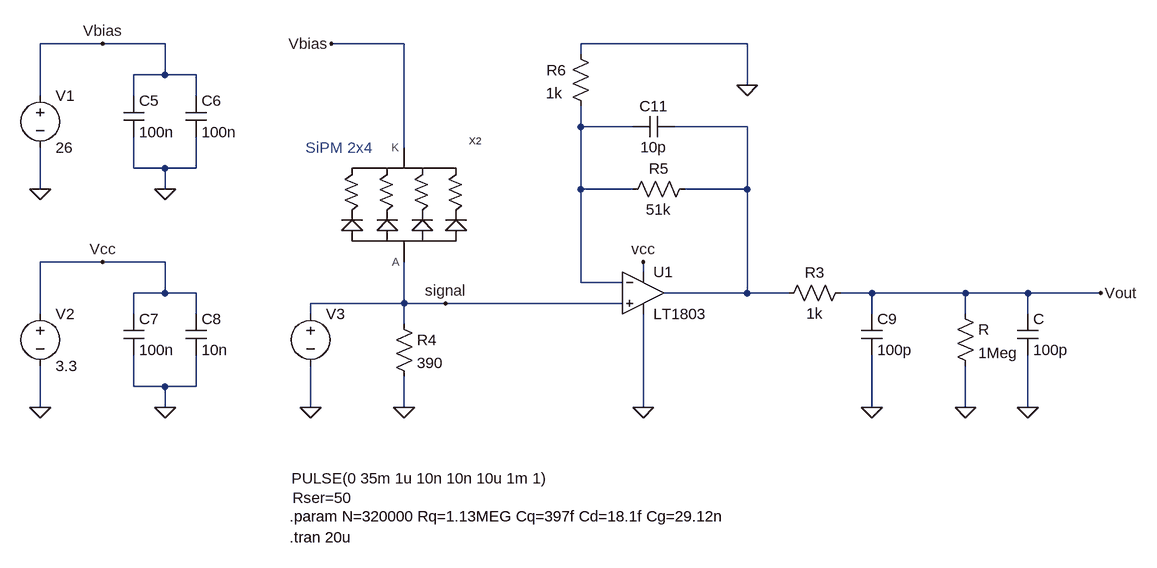
[diagram p0: schematic voltagemode_update.asc]
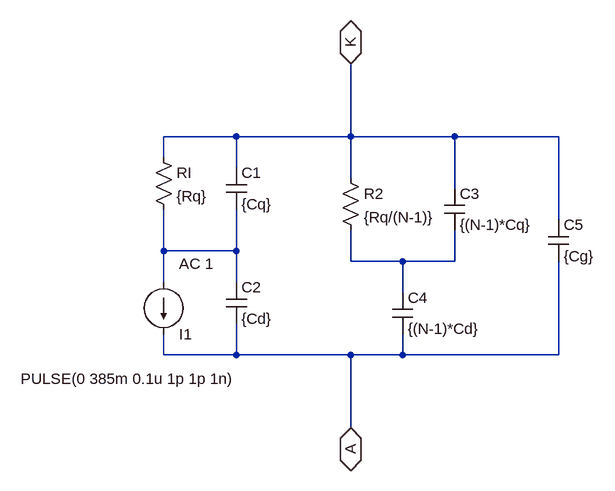
[diagram p1: sub-circuit sipm_equivalente_controllo_tensione_pulse.asc]
voltagemode_update.asc, the LTspice schematic file:
Version 4.1
SHEET 1 1304 1300
WIRE -432 -112 -528 -112
WIRE -336 -112 -432 -112
WIRE 32 -112 -80 -112
WIRE 560 -112 304 -112
WIRE 304 -96 304 -112
WIRE -336 -64 -336 -112
WIRE -336 -64 -384 -64
WIRE -288 -64 -336 -64
WIRE 560 -48 560 -112
WIRE -528 -32 -528 -112
WIRE -384 -32 -384 -64
WIRE -288 -32 -288 -64
WIRE 304 16 304 -16
WIRE 384 16 304 16
WIRE 560 16 448 16
WIRE 32 48 32 -112
WIRE -384 80 -384 32
WIRE -336 80 -384 80
WIRE -288 80 -288 32
WIRE -288 80 -336 80
WIRE -528 112 -528 48
WIRE -336 112 -336 80
WIRE 304 112 304 16
WIRE 384 112 304 112
WIRE 560 112 560 16
WIRE 560 112 464 112
WIRE -432 224 -528 224
WIRE -336 224 -432 224
WIRE 400 240 400 224
WIRE 304 256 304 112
WIRE 368 256 304 256
WIRE -336 272 -336 224
WIRE -336 272 -384 272
WIRE -288 272 -336 272
WIRE 560 272 560 112
WIRE 560 272 432 272
WIRE 624 272 560 272
WIRE 752 272 704 272
WIRE 896 272 752 272
WIRE 992 272 896 272
WIRE 1104 272 992 272
WIRE 32 288 32 224
WIRE 32 288 -112 288
WIRE 96 288 32 288
WIRE 368 288 96 288
WIRE -528 304 -528 224
WIRE -384 304 -384 272
WIRE -288 304 -288 272
WIRE -112 304 -112 288
WIRE 752 304 752 272
WIRE 896 304 896 272
WIRE 992 304 992 272
WIRE 32 320 32 288
WIRE -384 416 -384 368
WIRE -336 416 -384 416
WIRE -288 416 -288 368
WIRE -288 416 -336 416
WIRE -528 448 -528 384
WIRE -336 448 -336 416
WIRE -112 448 -112 384
WIRE 32 448 32 400
WIRE 400 448 400 304
WIRE 752 448 752 368
WIRE 896 448 896 384
WIRE 992 448 992 368
FLAG -528 112 0
FLAG -336 112 0
FLAG 32 448 0
FLAG 400 448 0
FLAG 400 224 vcc
FLAG 560 -48 0
FLAG 96 288 signal
FLAG -112 448 0
FLAG -432 -112 Vbias
FLAG -80 -112 Vbias
FLAG -528 448 0
FLAG -336 448 0
FLAG -432 224 Vcc
FLAG 752 448 0
FLAG 1104 272 Vout
FLAG 992 448 0
FLAG 896 448 0
SYMBOL voltage -528 -48 R0
WINDOW 123 0 0 Left 0
WINDOW 39 0 0 Left 0
SYMATTR InstName V1
SYMATTR Value 26
SYMBOL cap -400 -32 R0
SYMATTR InstName C5
SYMATTR Value 100n
SYMBOL res 16 304 R0
SYMATTR InstName R4
SYMATTR Value 390
SYMBOL res 288 -112 R0
WINDOW 0 -37 41 Left 2
WINDOW 3 -38 76 Left 2
SYMATTR InstName R6
SYMATTR Value 1k
SYMBOL res 480 96 R90
WINDOW 0 0 56 VBottom 2
WINDOW 3 32 56 VTop 2
SYMATTR InstName R5
SYMATTR Value 51k
SYMBOL sipm_equivalente_controllo_tensione_pulse 32 128 R0
SYMATTR InstName X2
SYMBOL voltage -112 288 R0
WINDOW 3 -29 269 Left 2
WINDOW 123 0 0 Left 0
WINDOW 39 -28 299 Left 2
SYMATTR Value PULSE(0 35m 1u 10n 10n 10u 1m 1)
SYMATTR SpiceLine Rser=50
SYMATTR InstName V3
SYMBOL cap -304 -32 R0
SYMATTR InstName C6
SYMATTR Value 100n
SYMBOL voltage -528 288 R0
WINDOW 123 0 0 Left 0
WINDOW 39 0 0 Left 0
SYMATTR InstName V2
SYMATTR Value 3.3
SYMBOL cap -400 304 R0
SYMATTR InstName C7
SYMATTR Value 100n
SYMBOL cap -304 304 R0
SYMATTR InstName C8
SYMATTR Value 10n
SYMBOL cap 448 0 R90
WINDOW 0 0 32 VBottom 2
WINDOW 3 32 32 VTop 2
SYMATTR InstName C11
SYMATTR Value 10p
SYMBOL res 720 256 R90
WINDOW 0 0 56 VBottom 2
WINDOW 3 32 56 VTop 2
SYMATTR InstName R3
SYMATTR Value 1k
SYMBOL cap 736 304 R0
SYMATTR InstName C9
SYMATTR Value 100p
SYMBOL cap 976 304 R0
SYMATTR InstName C
SYMATTR Value 100p
SYMBOL res 880 288 R0
SYMATTR InstName R
SYMATTR Value 1Meg
SYMBOL OpAmps\\LT1803 400 272 R0
SYMATTR InstName U1
TEXT -144 616 Left 2 !.param N=320000 Rq=1.13MEG Cq=397f Cd=18.1f Cg=29.12n
TEXT -144 648 Left 2 !.tran 20u
TEXT -120 48 Left 2 ;SiPM 2x4

sipm_equivalente_controllo_tensione_pulse.asc, the sub-circuit schematic file:
Version 4.1
SHEET 1 3028 692
WIRE 80 16 -32 16
WIRE 256 16 256 -96
WIRE 256 16 80 16
WIRE 416 16 256 16
WIRE 576 16 416 16
WIRE -32 48 -32 16
WIRE 80 64 80 16
WIRE 256 80 256 16
WIRE 416 96 416 16
WIRE 576 144 576 16
WIRE -32 192 -32 128
WIRE 80 192 80 128
WIRE 80 192 -32 192
WIRE 256 208 256 160
WIRE 336 208 256 208
WIRE 416 208 416 160
WIRE 416 208 336 208
WIRE -32 240 -32 192
WIRE 80 240 80 192
WIRE 336 256 336 208
WIRE -32 352 -32 320
WIRE 80 352 80 304
WIRE 80 352 -32 352
WIRE 256 352 80 352
WIRE 336 352 336 320
WIRE 336 352 256 352
WIRE 576 352 576 208
WIRE 576 352 336 352
WIRE 256 464 256 352
FLAG 256 464 A
IOPIN 256 464 BiDir
FLAG 256 -96 K
IOPIN 256 -96 BiDir
SYMBOL res -48 32 R0
SYMATTR InstName RI
SYMATTR Value {Rq}
SYMBOL res 240 64 R0
SYMATTR InstName R2
SYMATTR Value {Rq/(N-1)}
SYMBOL cap 64 64 R0
SYMATTR InstName C1
SYMATTR Value {Cq}
SYMBOL cap 64 240 R0
SYMATTR InstName C2
SYMATTR Value {Cd}
SYMBOL cap 400 96 R0
SYMATTR InstName C3
SYMATTR Value {(N-1)*Cq}
SYMBOL cap 320 256 R0
SYMATTR InstName C4
SYMATTR Value {(N-1)*Cd}
SYMBOL cap 560 144 R0
SYMATTR InstName C5
SYMATTR Value {Cg}
SYMBOL current -32 240 R0
WINDOW 0 24 80 Left 2
WINDOW 3 -220 149 Left 2
WINDOW 123 24 -28 Left 2
WINDOW 39 0 0 Left 2
SYMATTR InstName I1
SYMATTR Value PULSE(0 385m 0.1u 1p 1p 1n)
SYMATTR Value2 AC 1

The netlist it stands for:
* voltagemode_update.asc
V1 Vbias 0 26
C5 Vbias 0 100n
R4 signal 0 390
R6 0 N001 1k
R5 N002 N001 51k
X§X2 Vbias signal sipm_equivalente_controllo_tensione_pulse
V3 signal 0 PULSE(0 35m 1u 10n 10n 10u 1m 1) Rser=50
C6 Vbias 0 100n
V2 vcc 0 3.3
C7 vcc 0 100n
C8 vcc 0 10n
C11 N002 N001 10p
R3 Vout N002 1k
C9 Vout 0 100p
C Vout 0 100p
R Vout 0 1Meg
* U1: LT1803 (symbol OpAmps\LT1803 not available, pins judged from their places): In+=signal In-=N001 V+=vcc V-=0 OUT=N002

* block symbol definitions
.subckt sipm_equivalente_controllo_tensione_pulse K A
RI K N001 {Rq}
R2 K N002 {Rq/(N-1)}
C1 K N001 {Cq}
C2 N001 A {Cd}
C3 K N002 {(N-1)*Cq}
C4 N002 A {(N-1)*Cd}
C5 K A {Cg}
I1 N001 A PULSE(0 385m 0.1u 1p 1p 1n) AC 1
.ends sipm_equivalente_controllo_tensione_pulse

.param N=320000 Rq=1.13MEG Cq=397f Cd=18.1f Cg=29.12n
.tran 20u
* SiPM 2x4
.backanno
.end